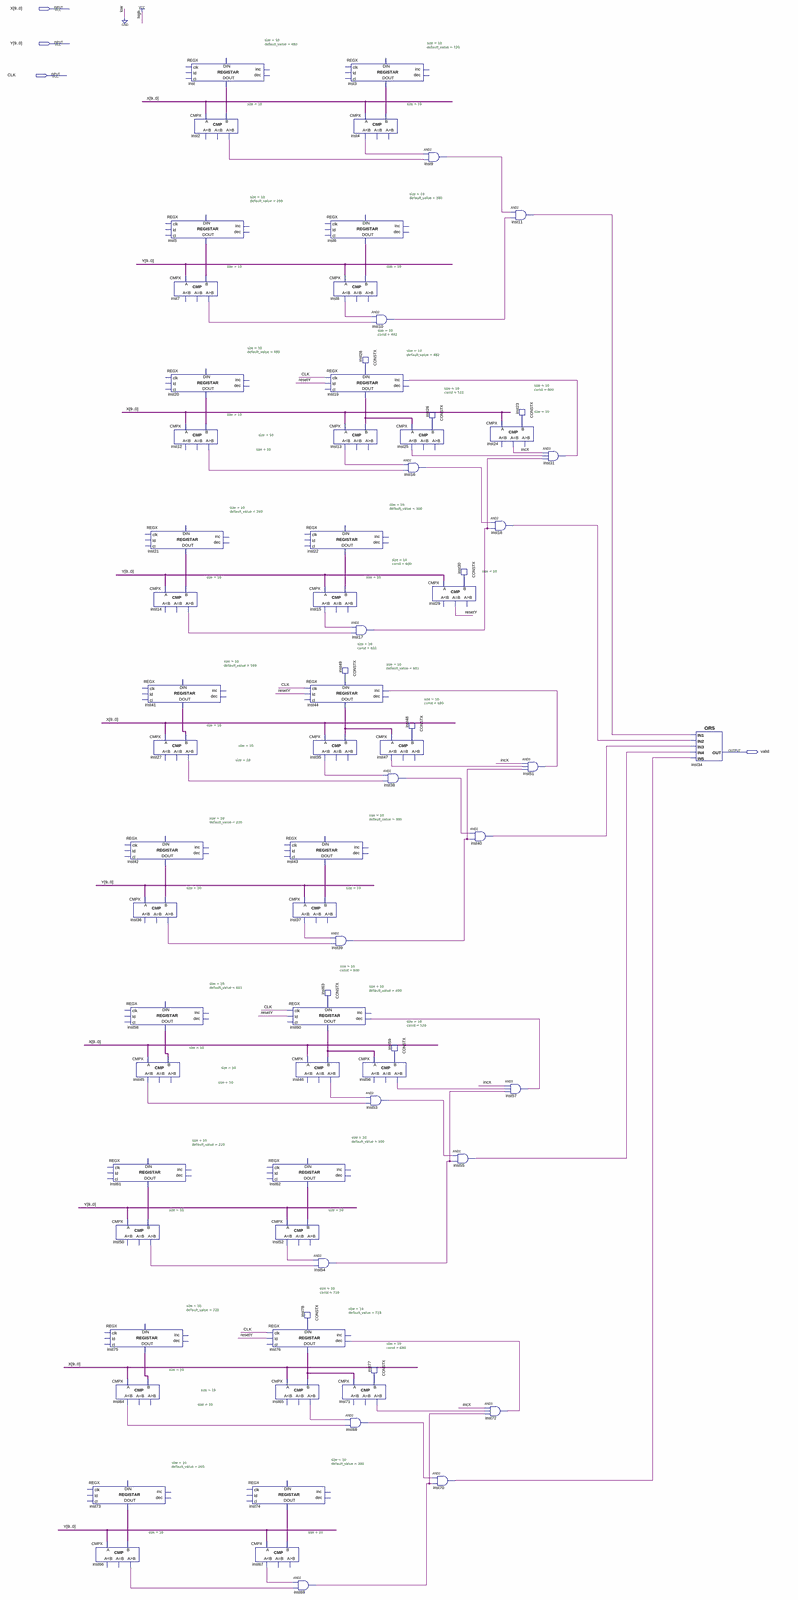
[diagram p0: schematic sheet, whole]
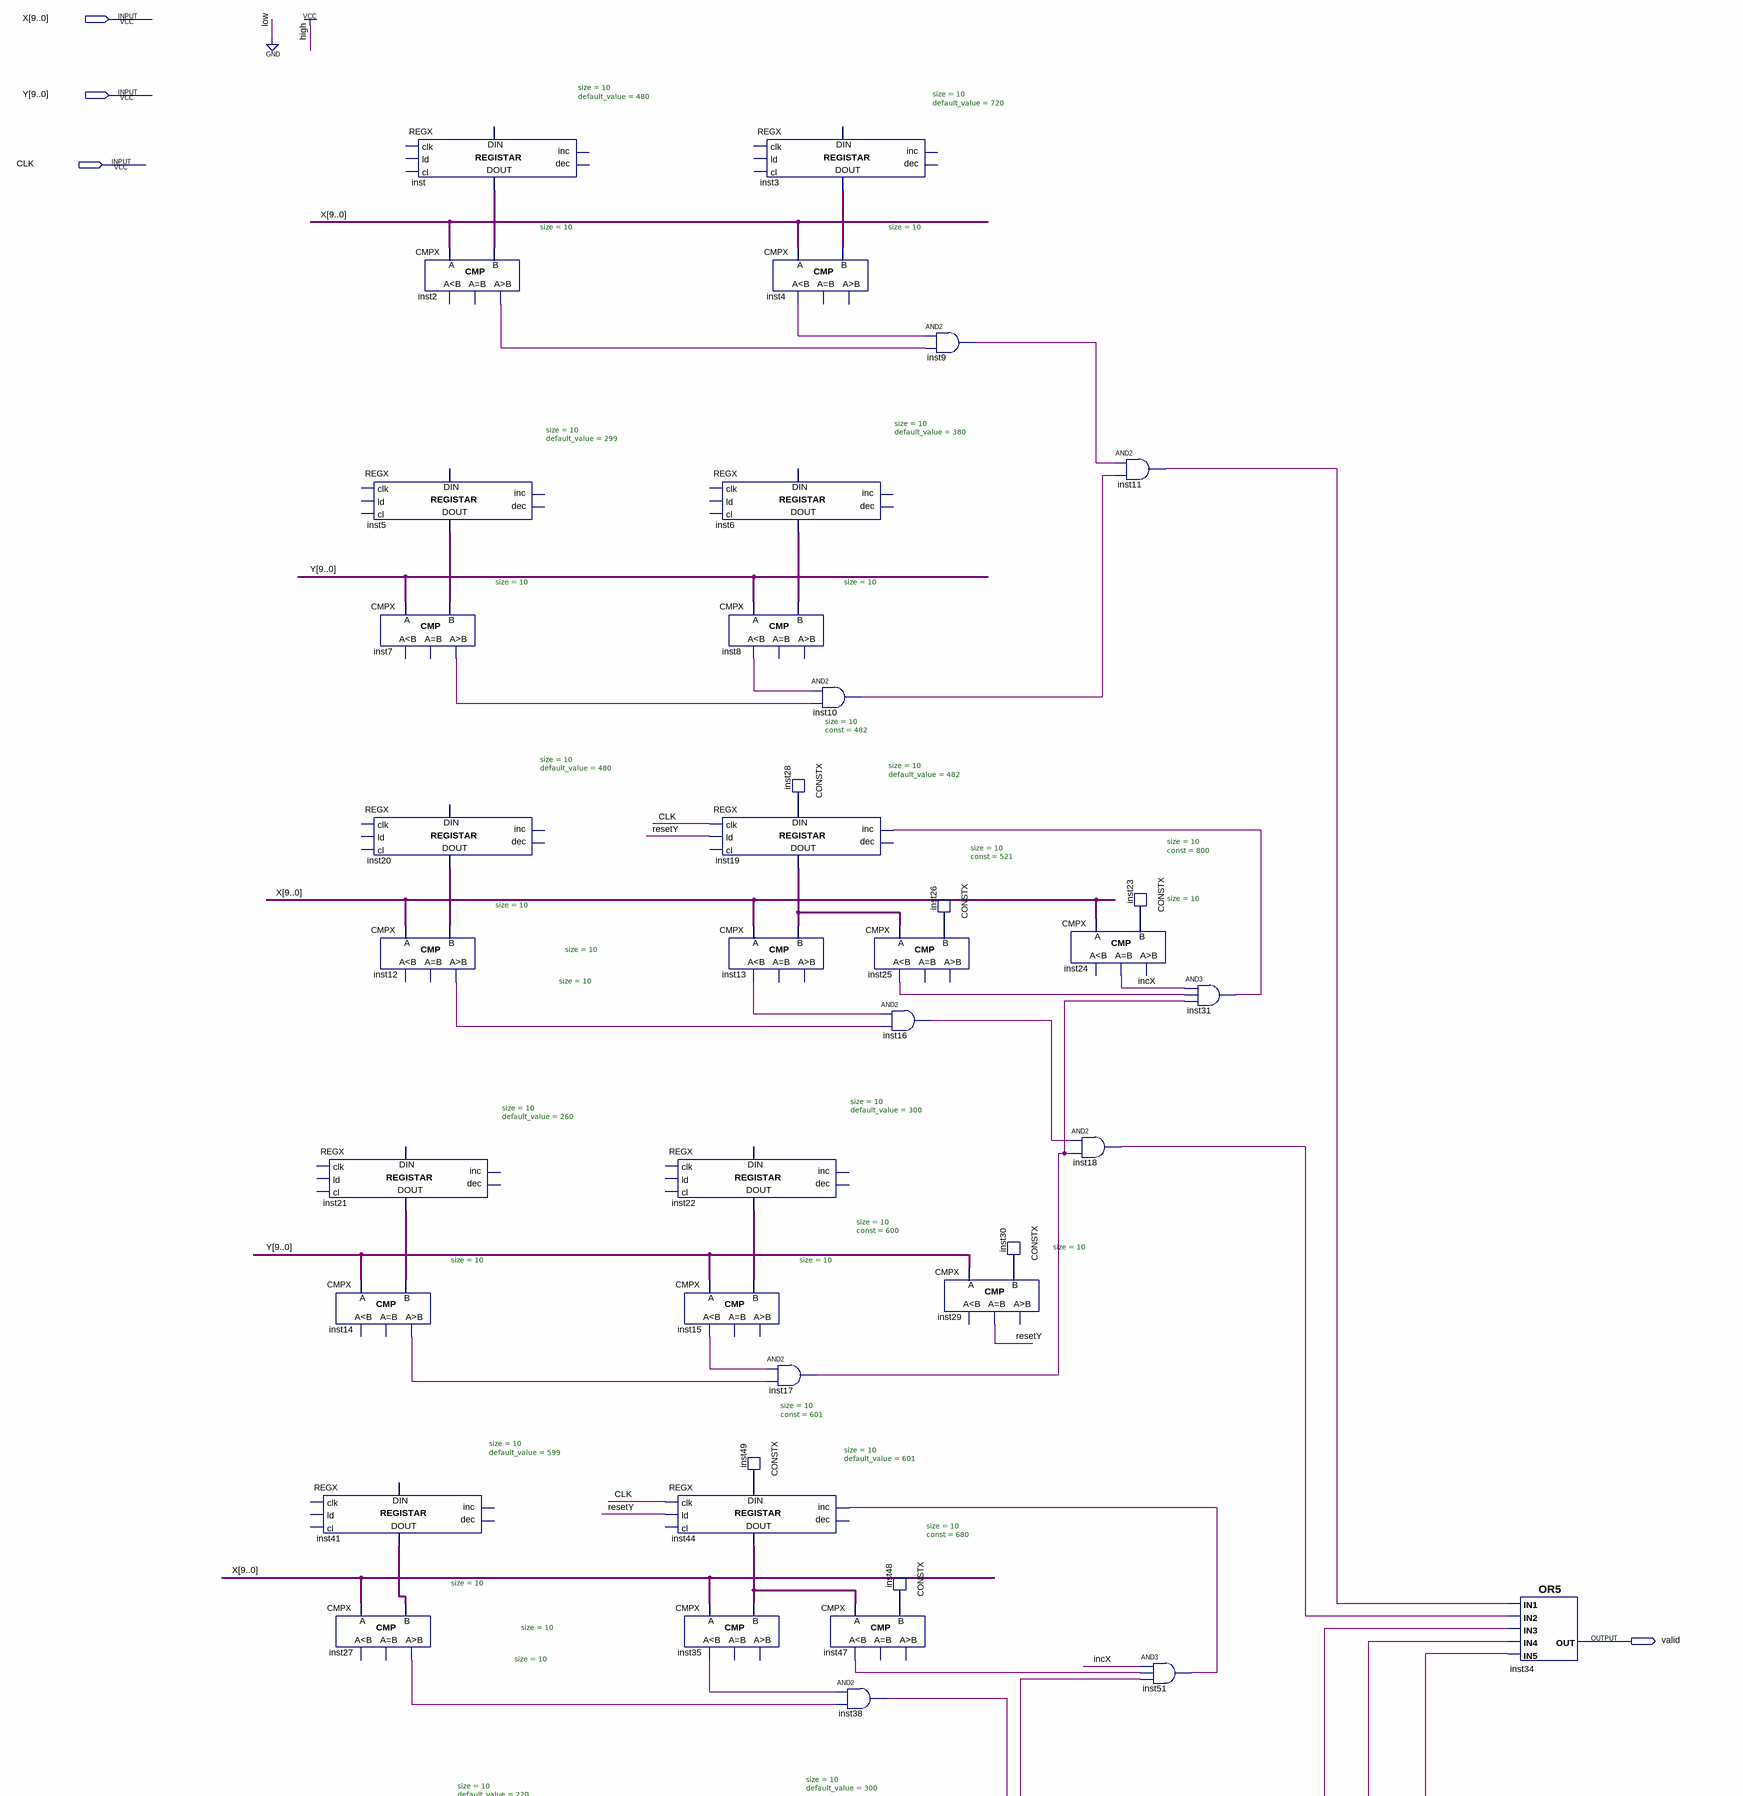
[diagram p1: schematic sheet, upper part]
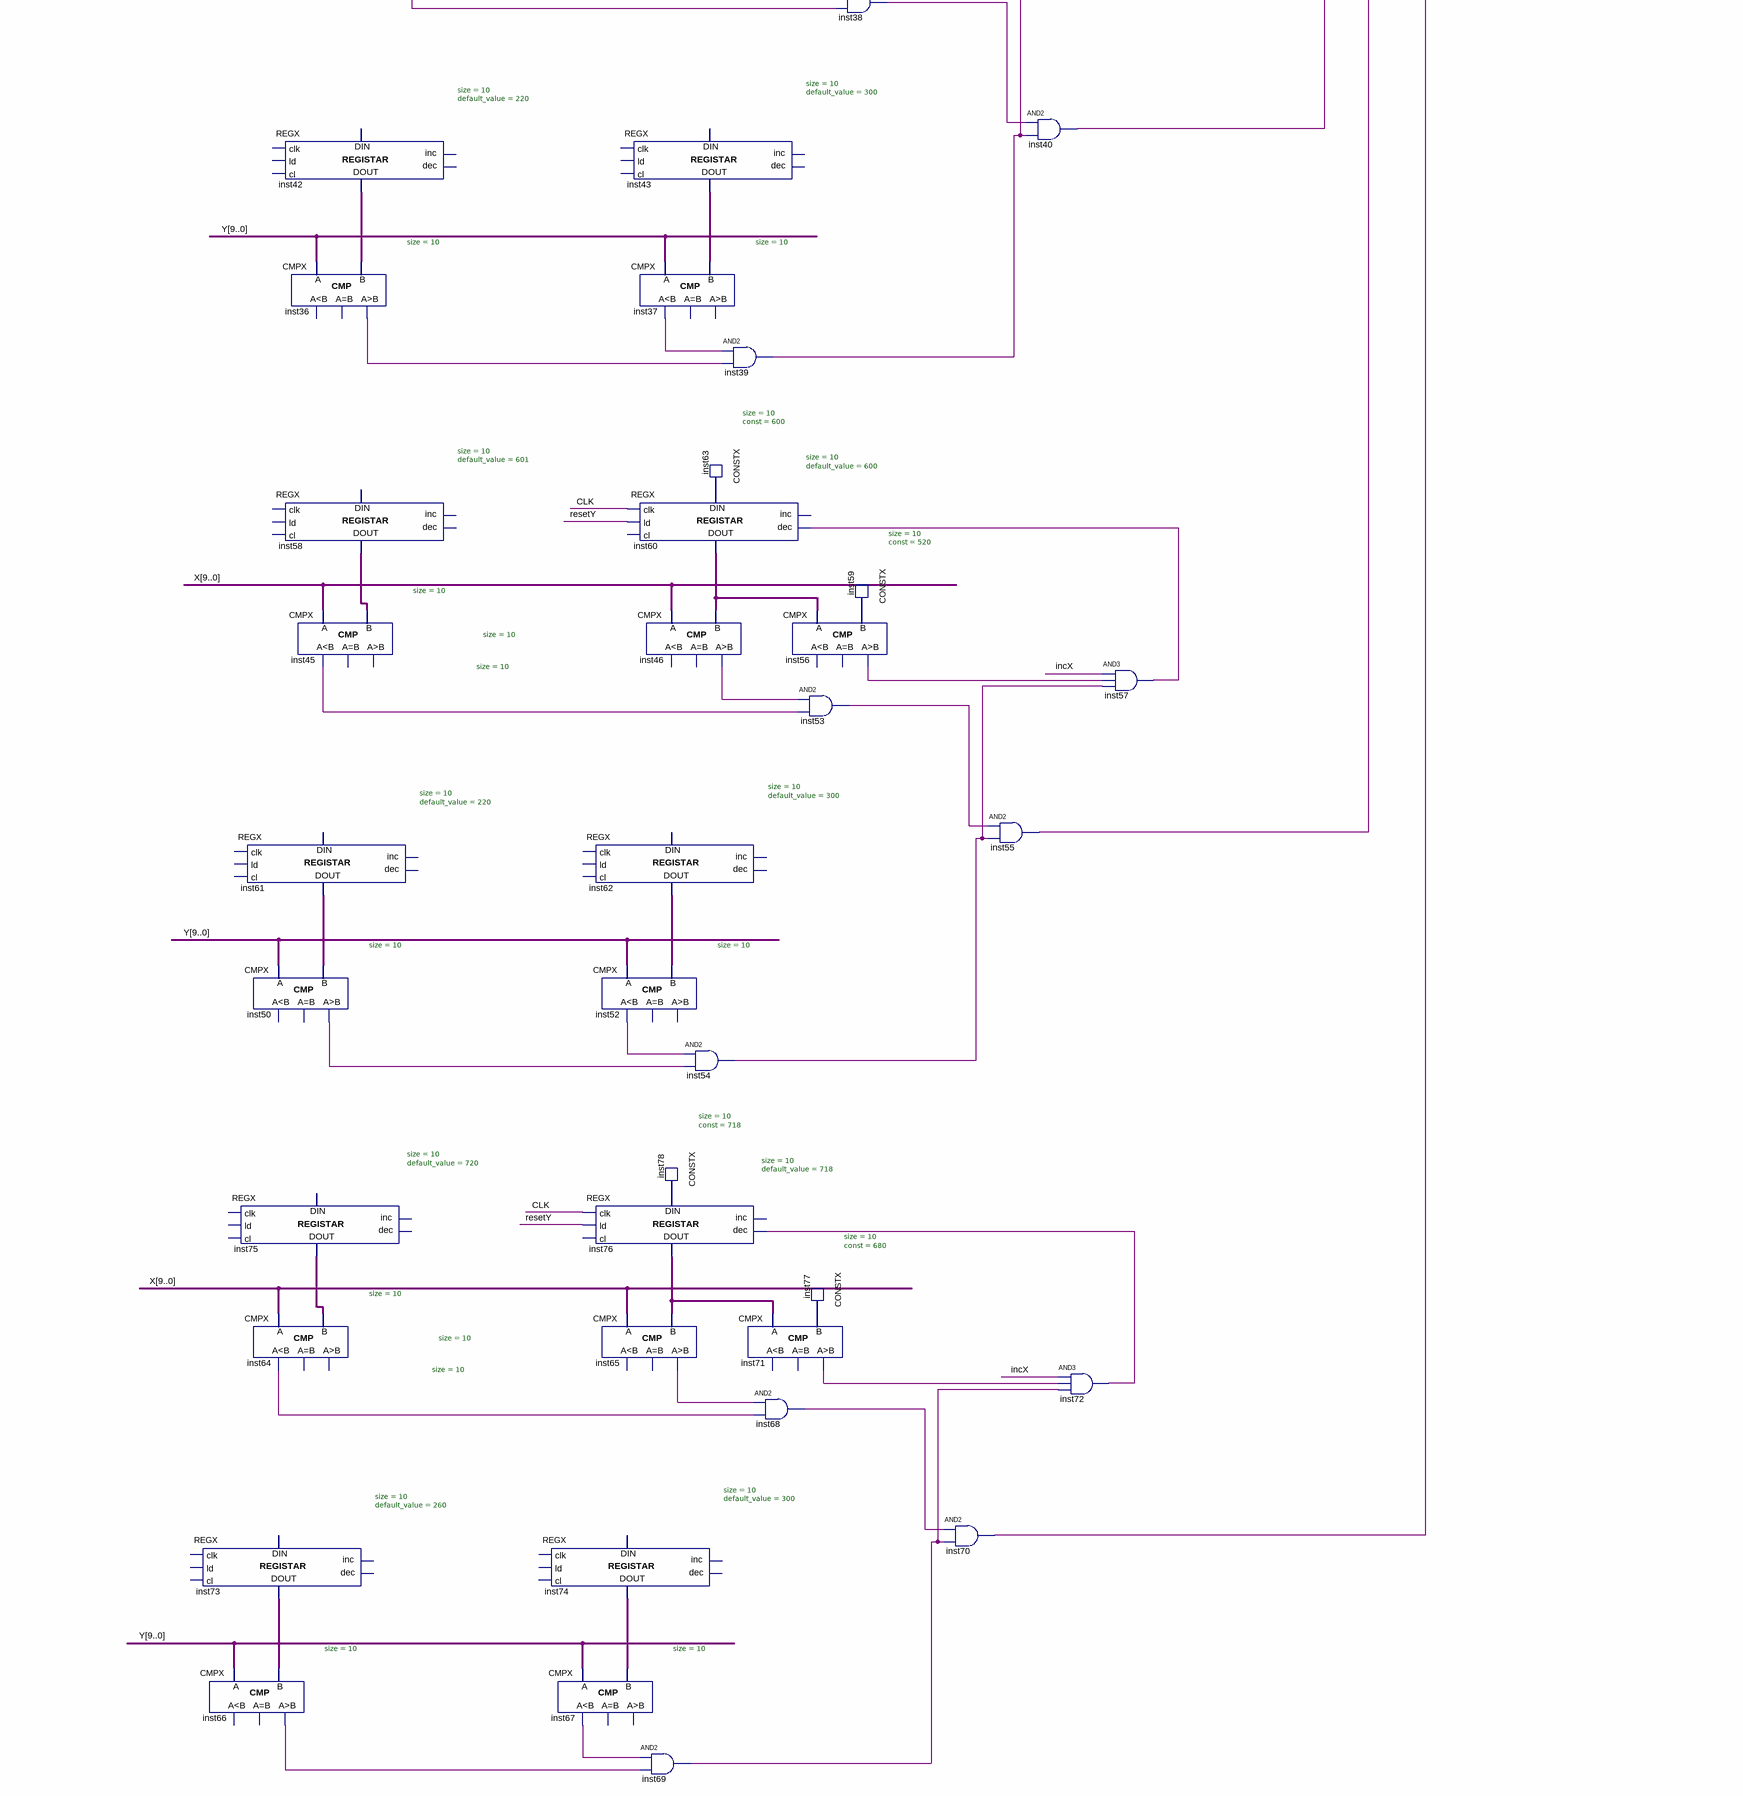
[diagram p2: schematic sheet, lower part]
// Quartus schematic Winner2.bdf as structural Verilog: 76 symbols, 4 pins
module Winner2 (
  input  [9:0] X,
  input  [9:0] Y,
  input  CLK,
  output valid
);

  wire incX, inst2_gr, inst4_ls, inst7_gr, inst8_ls, inst9_out, inst10_out, inst11_out, inst12_gr, inst13_ls,
       inst14_gr, inst15_ls, inst16_out, inst17_out, inst18_out, inst25_ls, inst27_gr, inst31_out, inst35_ls,
       inst36_gr, inst37_ls, inst38_out, inst39_out, inst40_out, inst45_ls, inst46_gr, inst47_ls, inst50_gr,
       inst51_out, inst52_ls, inst53_out, inst54_out, inst55_out, inst56_gr, inst57_out, inst64_ls,
       inst65_gr, inst66_gr, inst67_ls, inst68_out, inst69_out, inst70_out, inst71_gr, inst72_out, resetY;
  wire [9:0] inst3_data_out, inst5_data_out, inst6_data_out, inst19_data_out, inst20_data_out,
       inst21_data_out, inst22_data_out, inst23_data, inst26_data, inst28_data, inst30_data, inst41_data_out,
       inst42_data_out, inst43_data_out, inst44_data_out, inst48_data, inst49_data, inst58_data_out,
       inst59_data, inst60_data_out, inst61_data_out, inst62_data_out, inst63_data, inst73_data_out,
       inst74_data_out, inst75_data_out, inst76_data_out, inst77_data, inst78_data, inst_data_out;

  REGX #(.size(10), .default_value(260)) inst73 (.data_out(inst73_data_out));  // open: clk, ld, cl, inc, dec, data_in
  CMPX #(.size(10)) inst66 (.A(Y), .B(inst73_data_out), .gr(inst66_gr));  // open: ls, eq
  REGX #(.size(10), .default_value(220)) inst42 (.data_out(inst42_data_out));  // open: clk, ld, cl, inc, dec, data_in
  REGX #(.size(10), .default_value(601)) inst58 (.data_out(inst58_data_out));  // open: clk, ld, cl, inc, dec, data_in
  REGX #(.size(10), .default_value(220)) inst61 (.data_out(inst61_data_out));  // open: clk, ld, cl, inc, dec, data_in
  CMPX #(.size(10)) inst50 (.A(Y), .B(inst61_data_out), .gr(inst50_gr));  // open: ls, eq
  REGX #(.size(10), .default_value(720)) inst75 (.data_out(inst75_data_out));  // open: clk, ld, cl, inc, dec, data_in
  CMPX #(.size(10)) inst64 (.A(X), .B(inst75_data_out), .ls(inst64_ls));  // open: eq, gr
  REGX #(.size(10), .default_value(260)) inst21 (.data_out(inst21_data_out));  // open: clk, ld, cl, inc, dec, data_in
  CMPX #(.size(10)) inst14 (.A(Y), .B(inst21_data_out), .gr(inst14_gr));  // open: ls, eq
  REGX #(.size(10), .default_value(599)) inst41 (.data_out(inst41_data_out));  // open: clk, ld, cl, inc, dec, data_in
  CMPX #(.size(10)) inst27 (.A(X), .B(inst41_data_out), .gr(inst27_gr));  // open: ls, eq
  CMPX #(.size(10)) inst36 (.A(Y), .B(inst42_data_out), .gr(inst36_gr));  // open: ls, eq
  CMPX #(.size(10)) inst45 (.A(X), .B(inst58_data_out), .ls(inst45_ls));  // open: eq, gr
  REGX #(.size(10), .default_value(299)) inst5 (.data_out(inst5_data_out));  // open: clk, ld, cl, inc, dec, data_in
  CMPX #(.size(10)) inst7 (.A(Y), .B(inst5_data_out), .gr(inst7_gr));  // open: ls, eq
  REGX #(.size(10), .default_value(480)) inst20 (.data_out(inst20_data_out));  // open: clk, ld, cl, inc, dec, data_in
  CMPX #(.size(10)) inst12 (.A(X), .B(inst20_data_out), .gr(inst12_gr));  // open: ls, eq
  REGX #(.size(10), .default_value(480)) inst (.data_out(inst_data_out));  // open: clk, ld, cl, inc, dec, data_in
  CMPX #(.size(10)) inst2 (.A(X), .B(inst_data_out), .gr(inst2_gr));  // open: ls, eq
  REGX #(.size(10), .default_value(300)) inst74 (.data_out(inst74_data_out));  // open: clk, ld, cl, inc, dec, data_in
  CMPX #(.size(10)) inst67 (.A(Y), .B(inst74_data_out), .ls(inst67_ls));  // open: eq, gr
  REGX #(.size(10), .default_value(300)) inst43 (.data_out(inst43_data_out));  // open: clk, ld, cl, inc, dec, data_in
  CMPX #(.size(10)) inst37 (.A(Y), .B(inst43_data_out), .ls(inst37_ls));  // open: eq, gr
  REGX #(.size(10), .default_value(600)) inst60 (
    .clk(CLK), .ld(resetY), .dec(inst57_out), .data_in(inst63_data), .data_out(inst60_data_out));  // open: cl, inc
  REGX #(.size(10), .default_value(300)) inst62 (.data_out(inst62_data_out));  // open: clk, ld, cl, inc, dec, data_in
  CMPX #(.size(10)) inst52 (.A(Y), .B(inst62_data_out), .ls(inst52_ls));  // open: eq, gr
  REGX #(.size(10), .default_value(718)) inst76 (
    .clk(CLK), .ld(resetY), .dec(inst72_out), .data_in(inst78_data), .data_out(inst76_data_out));  // open: cl, inc
  CMPX #(.size(10)) inst65 (.A(X), .B(inst76_data_out), .gr(inst65_gr));  // open: ls, eq
  REGX #(.size(10), .default_value(300)) inst22 (.data_out(inst22_data_out));  // open: clk, ld, cl, inc, dec, data_in
  CMPX #(.size(10)) inst15 (.A(Y), .B(inst22_data_out), .ls(inst15_ls));  // open: eq, gr
  REGX #(.size(10), .default_value(601)) inst44 (
    .clk(CLK), .ld(resetY), .inc(inst51_out), .data_in(inst49_data), .data_out(inst44_data_out));  // open: cl, dec
  CMPX #(.size(10)) inst35 (.A(X), .B(inst44_data_out), .ls(inst35_ls));  // open: eq, gr
  CMPX #(.size(10)) inst46 (.A(X), .B(inst60_data_out), .gr(inst46_gr));  // open: ls, eq
  CONSTX #(.size(10), .\const (718)) inst78 (.data(inst78_data));
  and inst69 (inst69_out, inst67_ls, inst66_gr);
  REGX #(.size(10), .default_value(380)) inst6 (.data_out(inst6_data_out));  // open: clk, ld, cl, inc, dec, data_in
  CMPX #(.size(10)) inst8 (.A(Y), .B(inst6_data_out), .ls(inst8_ls));  // open: eq, gr
  REGX #(.size(10), .default_value(482)) inst19 (
    .clk(CLK), .ld(resetY), .inc(inst31_out), .data_in(inst28_data), .data_out(inst19_data_out));  // open: cl, dec
  CMPX #(.size(10)) inst13 (.A(X), .B(inst19_data_out), .ls(inst13_ls));  // open: eq, gr
  and inst39 (inst39_out, inst37_ls, inst36_gr);
  CONSTX #(.size(10), .\const (600)) inst63 (.data(inst63_data));
  and inst54 (inst54_out, inst52_ls, inst50_gr);
  REGX #(.size(10), .default_value(720)) inst3 (.data_out(inst3_data_out));  // open: clk, ld, cl, inc, dec, data_in
  CMPX #(.size(10)) inst4 (.A(X), .B(inst3_data_out), .ls(inst4_ls));  // open: eq, gr
  CONSTX #(.size(10), .\const (482)) inst28 (.data(inst28_data));
  and inst17 (inst17_out, inst15_ls, inst14_gr);
  CONSTX #(.size(10), .\const (601)) inst49 (.data(inst49_data));
  CMPX #(.size(10)) inst56 (.A(inst60_data_out), .B(inst59_data), .gr(inst56_gr));  // open: ls, eq
  CMPX #(.size(10)) inst71 (.A(inst76_data_out), .B(inst77_data), .gr(inst71_gr));  // open: ls, eq
  and inst68 (inst68_out, inst65_gr, inst64_ls);
  and inst10 (inst10_out, inst8_ls, inst7_gr);
  CMPX #(.size(10)) inst47 (.A(inst44_data_out), .B(inst48_data), .ls(inst47_ls));  // open: eq, gr
  and inst53 (inst53_out, inst46_gr, inst45_ls);
  CONSTX #(.size(10), .\const (680)) inst77 (.data(inst77_data));
  CMPX #(.size(10)) inst25 (.A(inst19_data_out), .B(inst26_data), .ls(inst25_ls));  // open: eq, gr
  and inst16 (inst16_out, inst13_ls, inst12_gr);
  CONSTX #(.size(10), .\const (680)) inst48 (.data(inst48_data));
  and inst38 (inst38_out, inst35_ls, inst27_gr);
  CONSTX #(.size(10), .\const (520)) inst59 (.data(inst59_data));
  and inst9 (inst9_out, inst4_ls, inst2_gr);
  CONSTX #(.size(10), .\const (521)) inst26 (.data(inst26_data));
  CMPX #(.size(10)) inst29 (.A(Y), .B(inst30_data), .eq(resetY));  // open: ls, gr
  and inst70 (inst70_out, inst68_out, inst69_out);
  CONSTX #(.size(10), .\const (600)) inst30 (.data(inst30_data));
  and inst40 (inst40_out, inst38_out, inst39_out);
  and inst55 (inst55_out, inst53_out, inst54_out);
  CMPX #(.size(10)) inst24 (.A(X), .B(inst23_data), .eq(incX));  // open: ls, gr
  and inst18 (inst18_out, inst16_out, inst17_out);
  and inst72 (inst72_out, incX, inst71_gr, inst69_out);
  and inst11 (inst11_out, inst9_out, inst10_out);
  CONSTX #(.size(10), .\const (800)) inst23 (.data(inst23_data));
  and inst57 (inst57_out, incX, inst56_gr, inst54_out);
  and inst31 (inst31_out, incX, inst25_ls, inst17_out);
  and inst51 (inst51_out, incX, inst47_ls, inst39_out);
  or inst34 (valid, inst11_out, inst18_out, inst40_out, inst55_out, inst70_out);
endmodule
